# EAGLE design RouteurPV2107d (EAGLE 9.6.2)
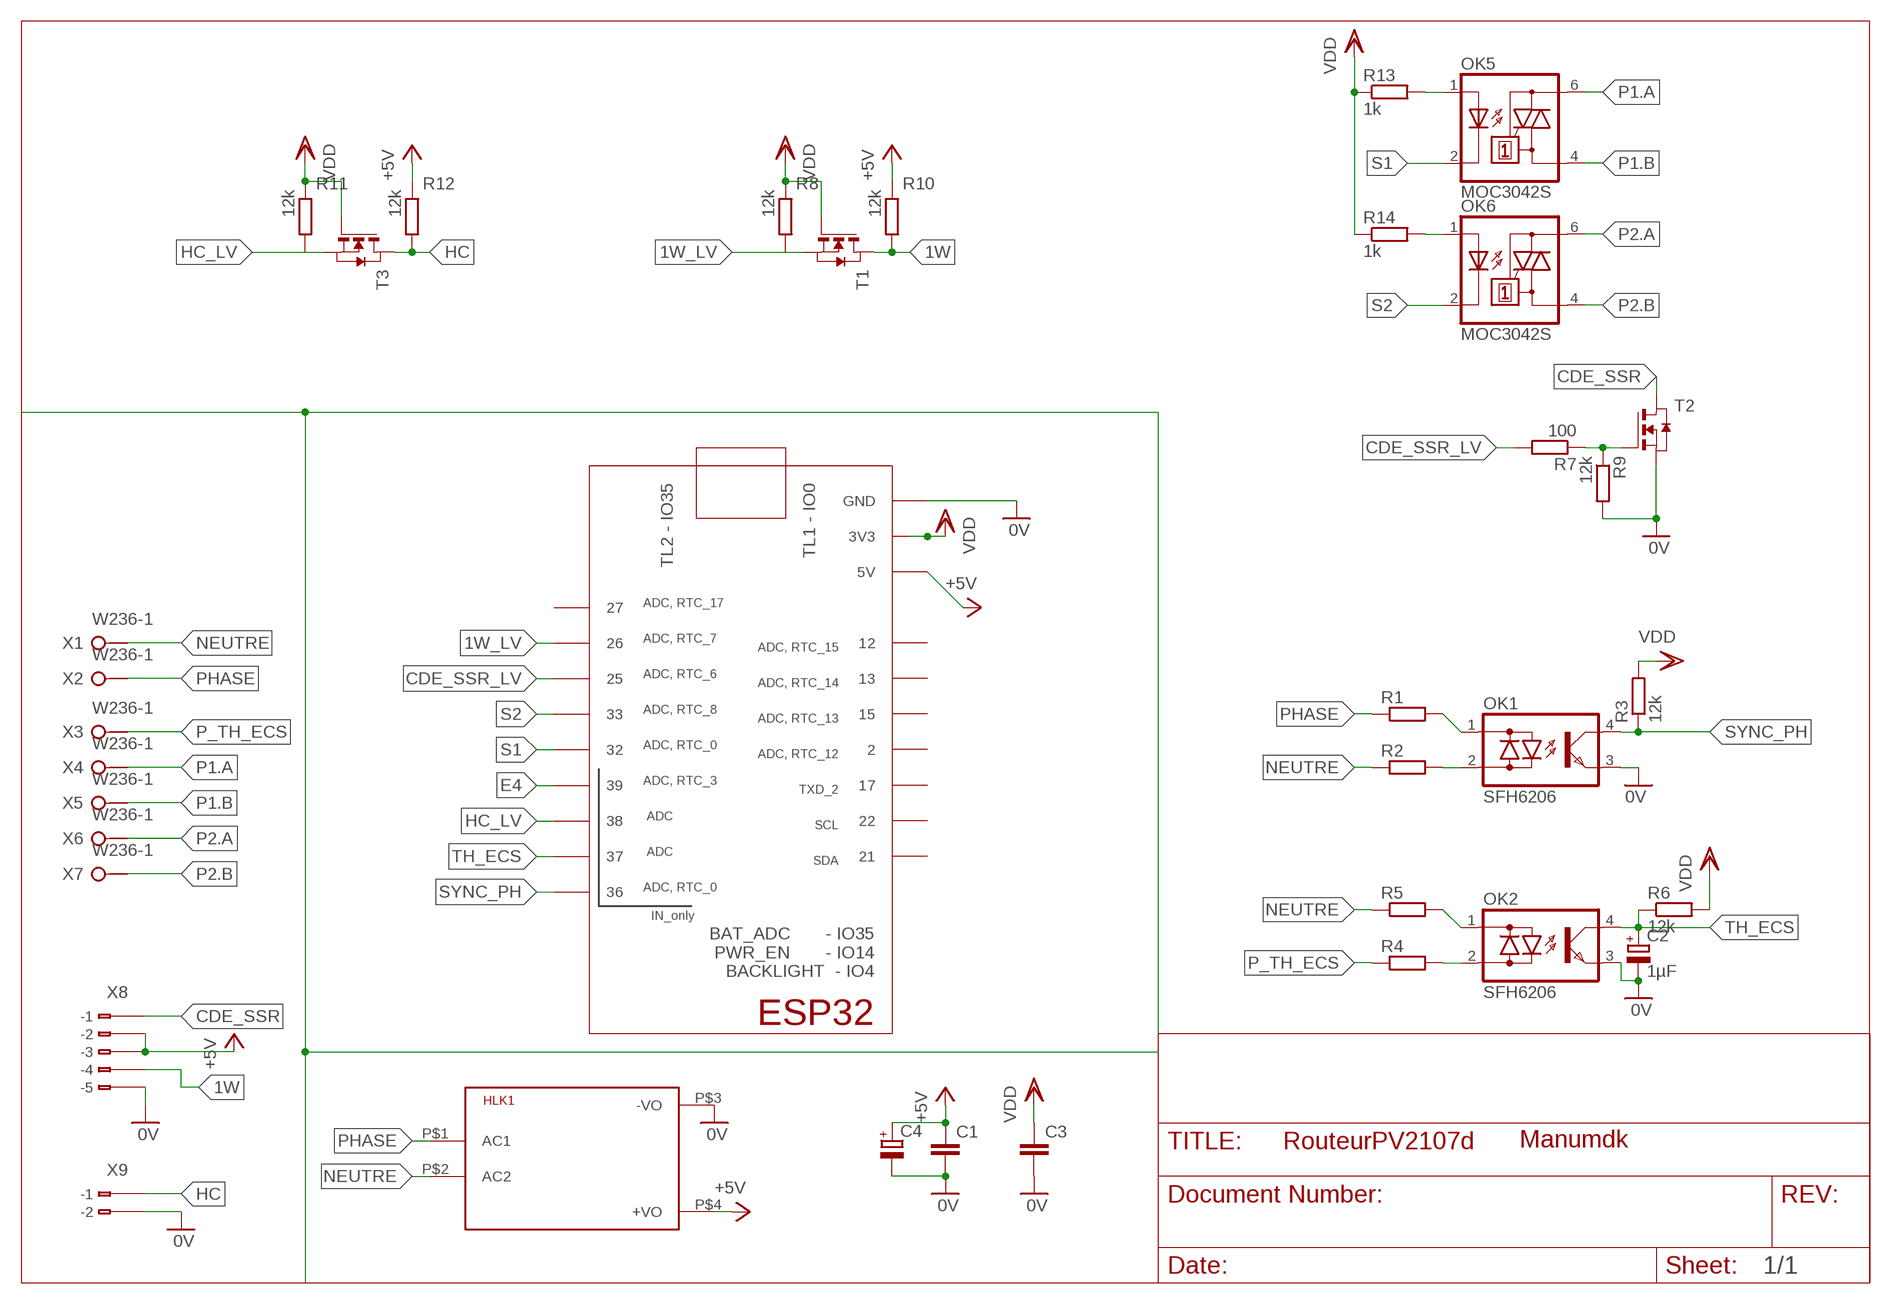
[diagram p0: schematic, sheet 1]
FRAME1 (DINA4_L): QUI: Manumdk

## Parts
C1  C-EUC1206  [C1206]
C2  1µF  CPOL-EUR/2012-12R  [R/2012-12R]
C3  C-EUC1206  [C1206]
C4  CPOL-EUSMCC  [SMC_C]
HLK1  HLK-PM013W  [HLK-PM01]
IC1  TTGO_DISP  [TTGO_DISP_DEFAULT]
OK1  SFH6206  [DIL4-SMD]
OK2  SFH6206  [DIL4-SMD]
OK5  MOC3042S  [DIL6-SMD]
OK6  MOC3042S  [DIL6-SMD]
R1  R-EU_R2512  [R2512]
R2  R-EU_R2512  [R2512]
R3  12k  R-EU_R1206  [R1206]
R4  R-EU_R2512  [R2512]
R5  R-EU_R2512  [R2512]
R6  12k  R-EU_R1206  [R1206]
R7  100  R-EU_R1206  [R1206]
R8  12k  R-EU_R1206  [R1206]
R9  12k  R-EU_R1206  [R1206]
R10  12k  R-EU_R1206  [R1206]
R11  12k  R-EU_R1206  [R1206]
R12  12k  R-EU_R1206  [R1206]
R13  1k  R-EU_R1206  [R1206]
R14  1k  R-EU_R1206  [R1206]
T1  NMOSSOT23  [SOT-23]
T2  NMOSSOT23  [SOT-23]
T3  NMOSSOT23  [SOT-23]
X1  W236-1  [W236-1]
X2  W236-1  [W236-1]
X3  W236-1  [W236-1]
X4  W236-1  [W236-1]
X5  W236-1  [W236-1]
X6  W236-1  [W236-1]
X7  W236-1  [W236-1]
X8  233-505  [233-505]
X9  233-102  [233-102]

## Nets
0V [Alim]: C1.2 C2.- C3.2 C4.- HLK1.P$3(-VO) IC1.GND_1(GND) IC1.GND_2(GND) IC1.GND_3(GND) IC1.GND_4(GND) IC1.GND_5(GND) OK1.3(E) OK2.3(E) R9.2 T2.2(S) X8.B5(B-5) X9.B2(B-2)
1W: R10.2 T1.1(D) X8.B4(B-4)
1W_LV: IC1.26 R8.2 T1.2(S)
+5V [Alim]: C1.1 C4.+ HLK1.P$4(+VO) IC1.5V R10.1 R12.1 X8.B2(B-2) X8.B3(B-3)
CDE_SSR: T2.1(D) X8.B1(B-1)
CDE_SSR_LV: IC1.25 R7.2
E4: IC1.39
HC: R12.2 T3.1(D) X9.B1(B-1)
HC_LV: IC1.38 R11.2 T3.2(S)
N$1 [220V]: OK1.1(AC1) R1.2
N$2: R7.1 R9.1 T2.3(G)
N$6 [220V]: OK1.2(AC2) R2.2
N$7 [220V]: OK2.2(AC2) R4.2
N$10 [220V]: OK2.1(AC1) R5.2
N$25: OK5.1(A) R13.2
N$26: OK6.1(A) R14.2
NEUTRE [220V]: HLK1.P$2(AC2) R2.1 R5.1 X1.1(KL1)
P1.A [220V]: OK5.6(A2) X4.1(KL1)
P1.B [220V]: OK5.4(A1) X5.1(KL1)
P2.A [220V]: OK6.6(A2) X6.1(KL1)
P2.B [220V]: OK6.4(A1) X7.1(KL1)
P_TH_ECS [220V]: R4.1 X3.1(KL1)
PHASE [220V]: HLK1.P$1(AC1) R1.1 X2.1(KL1)
S1: IC1.32 OK5.2(C)
S2: IC1.33 OK6.2(C)
SYNC_PH: IC1.36 OK1.4(C) R3.1
TH_ECS: C2.+ IC1.37 OK2.4(C) R6.1
VDD [Alim]: C3.1 IC1.3V3_1(3V3) IC1.3V3_2(3V3) R3.2 R6.2 R8.1 R11.1 R13.1 R14.1 T1.3(G) T3.3(G)
Unconnected: IC1.2 IC1.12 IC1.13 IC1.15 IC1.17 IC1.21 IC1.22 IC1.27 X1.2(KL2) X2.2(KL2) X3.2(KL2) X4.2(KL2) X5.2(KL2) X6.2(KL2) X7.2(KL2) X8.A1(-1) X8.A2(-2) X8.A3(-3) X8.A4(-4) X8.A5(-5) X9.A1(-1) X9.A2(-2)

## Library data of the parts
C1 C3 = rcl:C-EU: CAPACITOR, European symbol; SPICEPREFIX: C
C2 C4 = rcl:CPOL-EU: POLARIZED CAPACITOR, European symbol; SPICEPREFIX: C
HLK1 = HLK-PM01:HLK-PM01: Hi-Link Power Supply HLK-PM01 3W Author: Ahmed Said <https://github.com/AhmedSaid/EAGLELibraries>
IC1 = TTGO_LCD_DISP:TTGO_DISP; HEIGHT: 11
OK1 OK2 = optocoupler:SFH620: Optocoupler, Phototransistor Output, AC Input Source: http://www.vishay.com/docs/83675/sfh620.pdf; MF: VISHAY/TELEFUNKEN; MPN: SFH6206-3; OC_FARNELL: 1469585; OC_NEWARK: 58K2214
OK5 OK6 = optocoupler:MOC30*: 6-Pin DIP Zero-Cross Optoisolators Triac Driver Output (250/400 Volt Peak) Source: Data sheet <http://www.fairchildsemi.com/ds/MO/MOC3031M.pdf> The old path of data sheet not more available 2013-05-06.; MF: FAIRCHILD SEMICONDUCTOR; MPN: MOC3042SM; OC_FARNELL: unknown; OC_NEWARK: 34C1339
R1-R14 = rcl:R-EU_: RESISTOR, European symbol; SPICEPREFIX: R
T1-T3 = zetex:NMOSSOT23: MOS FET; OC_FARNELL: unknown; OC_NEWARK: unknown
X1-X7 = con-wago-508:W236-1: WAGO SREW CLAMP; OC_FARNELL: unknown; OC_NEWARK: unknown
X8 = con-wago:233-505: WAGO Cage Clamp; MF: Wago Corporation; MPN: 0233-0505; OC_FARNELL: unknown; OC_NEWARK: 79K2051
X9 = con-wago:233-102: WAGO Cage Clamp; MPN: 233-102; OC_FARNELL: unknown; OC_NEWARK: 28K9044

## Net classes
1 220V: width 1 mm, clearance 1.2 mm to class 0, clearance 1.2 mm
2 Alim: width 1 mm

## Board
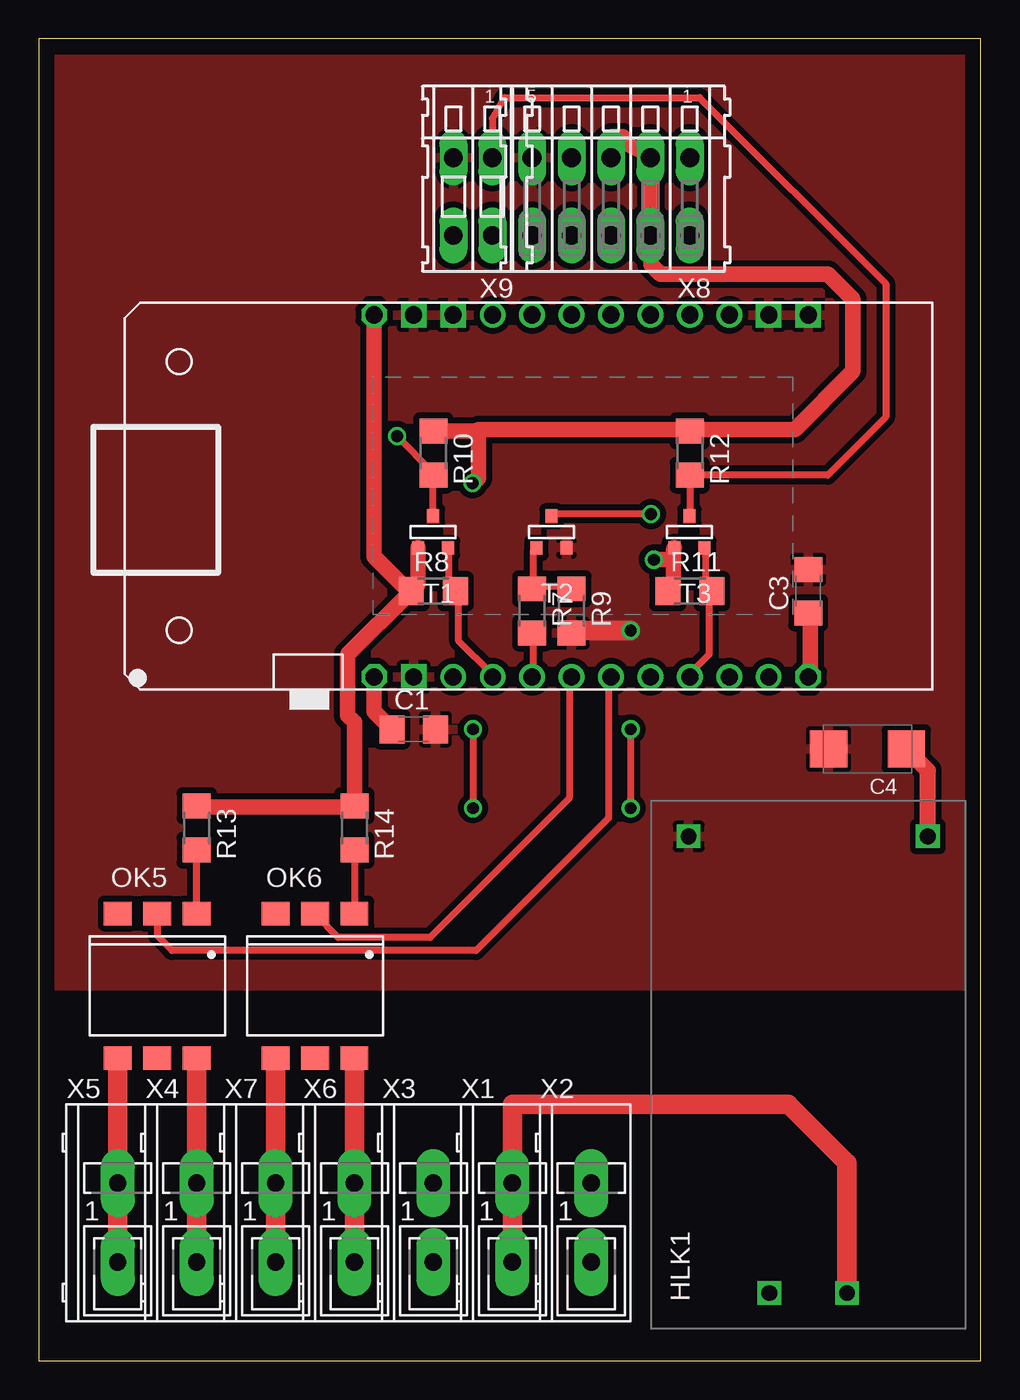
[diagram p1: board, top side]
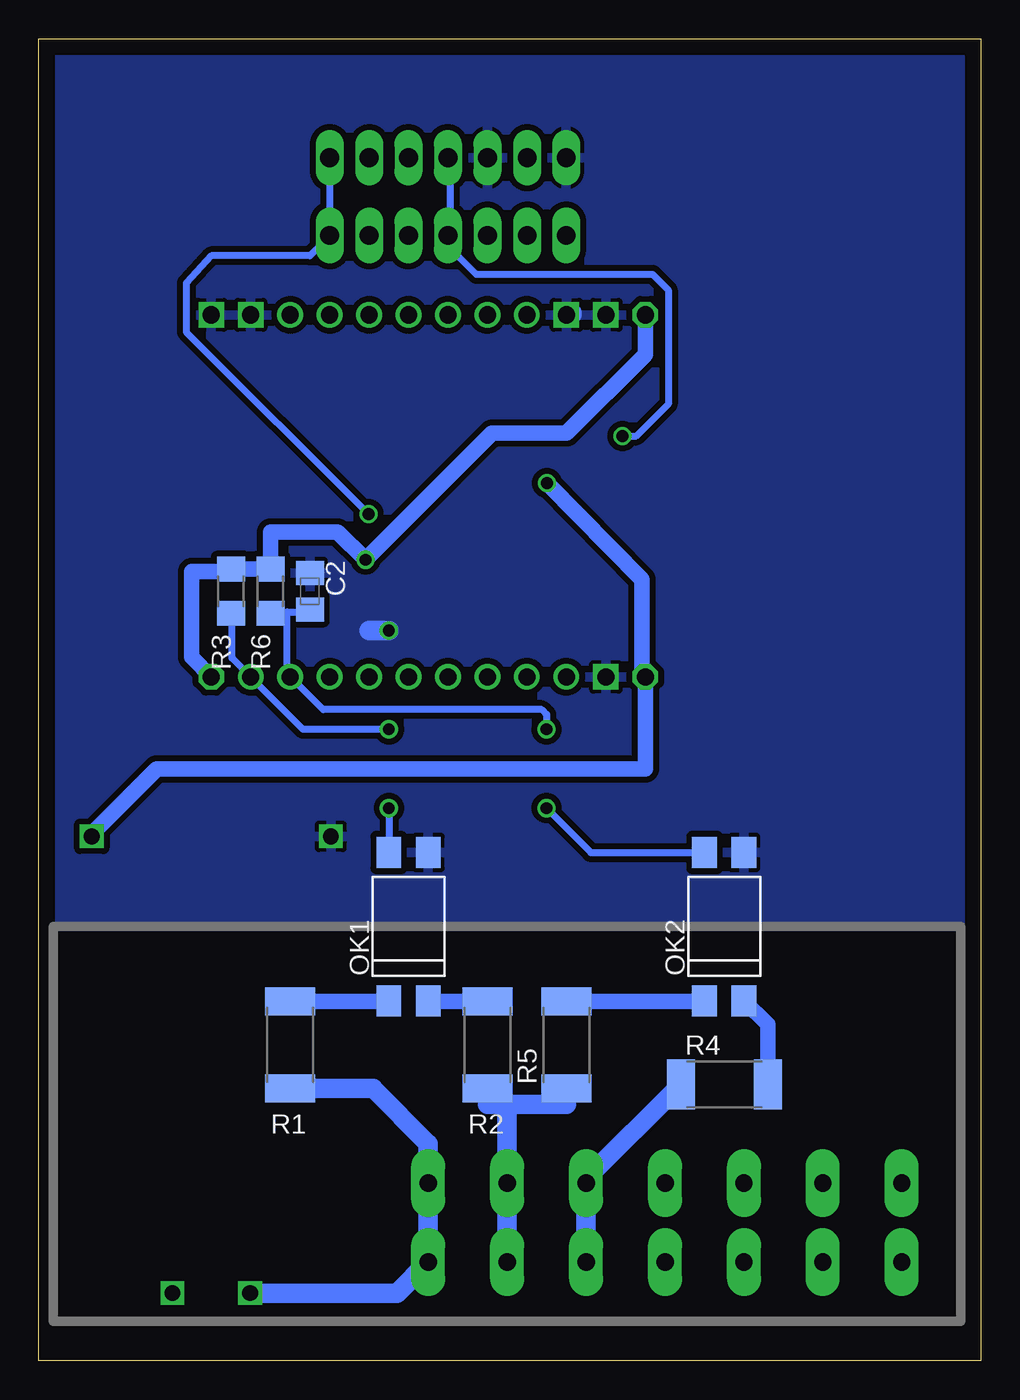
[diagram p2: board, bottom side, seen from below]

Size 60.63 x 85.08 mm. Coordinates in mm from the lower left corner, seen from the top.
Outline: 0,0 60.63,0 60.63,85.08 0,85.08 0,0
Copper layers (1*16): Top 0.035mm / dielectric 1.5mm / Bottom 0.035mm
Design rules "Manu1610a": minimum track width 18mil, minimum drill 30mil, track to track 15mil, track to pad 15mil, pad to pad 15mil, via to via 15mil, smd to smd 8mil, copper to edge 40mil, drill to drill 8mil, minimum pad ring 10mil, minimum via ring 8mil, stop-mask expansion 4mil, vias tented up to drill 0mil, thermal gap 10mil

### Footprints (pad centres in the part's own frame; a part is rotated, then mirrored left to right if it is on the bottom)
C1206 = smd 1.6 x 1.8: 1 -1.4,0; 2 1.4,0
R/2012-12R = smd 1.55 x 1.8: + 1.175,0; - -1.175,0
SMC_C = smd 2.4 x 2.4: + -2.5,0; - 2.5,0
HLK-PM01 = drill 1.016 square: P$1 -14.7,2.5; P$2 -14.7,-2.5; P$3 14.7,7.7; P$4 14.7,-7.7
TTGO_DISP_DEFAULT = drill 1.1: 2 12.7,0; 12 20.32,0; 13 17.78,0; 15 15.24,0; 17 10.16,0; 21 5.08,0; 22 7.62,0; 25 17.78,23.3; 26 20.32,23.3; 27 22.86,23.3; 32 12.7,23.3; 33 15.24,23.3; 36 2.54,23.3; 37 5.08,23.3; 38 7.62,23.3; 39 10.16,23.3 | drill 1.1 octagon: 3V3_1 0,23.3; 3V3_2 27.94,0; 5V 27.94,23.3 | drill 1.1 square: GND_1 0,0; GND_2 2.54,0; GND_3 22.86,0; GND_4 25.4,0; GND_5 25.4,23.3
DIL4-SMD = smd 1.6 x 2: 1 -1.27,-4.77; 2 1.27,-4.77; 3 1.27,4.77; 4 -1.27,4.77
DIL6-SMD = smd 1.78 x 1.52: 1 -2.54,-4.645; 2 0,-4.645; 3 2.54,-4.645; 4 2.54,4.645; 5 0,4.645; 6 -2.54,4.645
R2512 = smd 1.8 x 3.2: 1 -2.8,0; 2 2.8,0
R1206 = smd 1.6 x 1.803: 1 -1.422,0; 2 1.422,0
SOT-23 = smd 0.787 x 0.889: 1 0.025,-1.016; 2 -0.94,1.016; 3 0.991,1.016
W236-1 = drill 1.118 pad 2.184 long: 1 0,-2.54; 2 0,2.54
233-505 = drill 1.2 long: A1 -5.08,2.5; A2 -2.54,2.5; A3 0,2.5; A4 2.54,2.5; A5 5.08,2.5; B1 -5.08,-2.5; B2 -2.54,-2.5; B3 0,-2.5; B4 2.54,-2.5; B5 5.08,-2.5
233-102 = drill 1.2 long: A1 -1.25,2.5; A2 1.25,2.5; B1 -1.25,-2.5; B2 1.25,-2.5

### Placement (x,y rotation side)
C1  24.13,40.64 0 top
C2  43.18,49.53 270 bottom
C3  49.53,49.53 90 top
C4  53.34,39.37 180 top
HLK1  49.53,19.05 90 top
IC1  49.53,67.31 180 top
OK1  36.83,27.94 0 bottom
OK2  16.51,27.94 0 bottom
OK5  7.62,24.13 180 top
OK6  17.78,24.13 180 top
R1  44.45,20.32 90 bottom
R2  31.75,20.32 90 bottom
R3  48.26,49.53 90 bottom
R4  16.51,17.78 0 bottom
R5  26.67,20.32 90 bottom
R6  45.72,49.53 90 bottom
R7  31.75,48.26 270 top
R8  25.4,49.53 0 top
R9  34.29,48.26 270 top
R10  25.4,58.42 270 top
R11  41.91,49.53 0 top
R12  41.91,58.42 270 top
R13  10.16,34.29 270 top
R14  20.32,34.29 270 top
T1  25.4,53.34 180 top
T2  33.02,53.34 180 top
T3  41.91,53.34 180 top
X1  30.48,8.89 0 top
X2  35.56,8.89 0 top
X3  25.4,8.89 0 top
X4  10.16,8.89 0 top
X5  5.08,8.89 0 top
X6  20.32,8.89 0 top
X7  15.24,8.89 0 top
X8  36.83,74.93 180 top
X9  27.94,74.93 180 top

### Tracks (layer width: path | path; a pad name or v marks a point on that pad's centre or on a via)
0V  (via drill 0.76)
  Top 1.27: R9.2 34.44,46.99 v38.1,46.99
  Bottom 1: 26.19,67.31 26.19,67.47 IC1.GND_3
  Bottom 1.27: v38.1,46.99 39.37,46.99
  pour Top (isolate 0.254): 59.69,24.13 59.69,85.09 0,85.09 0,24.13
  pour Bottom (isolate 0.254): 59.69,27.94 59.69,83.82 1.27,83.82 1.27,27.94
1W  (via drill 0.76)
  Top 0.457: T1.1 25.36,54.48 25.36,57 R10.2 25.36,57.21 v23.05,59.51
  Bottom 0.457: v23.05,59.51 22.16,59.51 20.12,61.56 20.12,68.92 21.13,69.93 32.48,69.93 34.16,71.6 34.16,77.31 X8.B4
1W_LV
  Top 0.457: T1.2 26.4,52.18 26.4,49.87 26.61,49.66 R8.2 27.03,49.45 27.03,46.31 29.13,44.22 IC1.26
+5V  (via drill 0.76)
  Top 1: X8.B3 37.59,78.79 36.88,78.79 39.11,77.69 X8.B2 39.4,77.31 39.4,70.54 40.01,69.93 50.79,69.93 52.4,68.31 52.4,63.68 48.65,59.93 42.12,59.93 R12.1 41.91,59.93 28.3,59.93 | 28.3,59.93 28.3,56.8 v27.91,56.5 | IC1.5V 21.59,41.78 C1.1 | R10.1 28.21,59.84 28.3,59.93
  Top 1.016: HLK1.P$4 57.23,37.98 C4.+
  Bottom 1: v27.91,56.5 21.79,50.29 21.79,44.22 IC1.5V 21.59,38.1 53.05,38.1 57.21,33.95 HLK1.P$4
CDE_SSR  (via drill 0.76)
  Top 0.457: v39.4,54.48 33.11,54.48 T2.1
  Bottom 0.457: v39.4,54.48 51.13,66.22 51.13,69.36 49.53,71.12 43.18,71.12 41.91,72.39 X8.B1
CDE_SSR_LV
  Top 0.457: R7.2 31.85,46.73 31.85,44.22 IC1.25
HC
  Top 0.457: T3.1 41.91,54.48 R12.2 42.12,57 50.79,57 54.51,60.72 54.51,69.34 42.54,81.31 29.95,81.31 29.19,79.97 X9.B1
HC_LV
  Top 0.457: T3.2 42.96,52.18 42.96,49.87 43.17,49.66 R11.2 43.17,49.45 43.17,45.47 41.91,44.22 IC1.38
N$1
  Bottom 1: R1.2 38.15,23.12 OK1.1
N$2
  Top 0.457: T2.3 31.85,52.18 31.85,49.87 R7.1 32.06,49.87 34.16,49.87 R9.1
N$6
  Bottom 1: R2.2 35.51,23.12 OK1.2
N$7
  Bottom 1: R4.2 13.71,21.64 OK2.2
N$10
  Bottom 1: R5.2 17.83,23.12 OK2.1
N$25
  Top 0.457: OK5.1 R13.2
N$26
  Top 0.457: OK6.1 20.33,28.92 20.33,32.69 R14.2
NEUTRE
  Top 1.27: X1.1 30.48,16.51 48.26,16.51 52.03,12.74 HLK1.P$2
  Bottom 1.27: R5.1 26.67,16.51 30.48,16.51 | 30.48,16.51 31.75,16.51 R2.1 | X1.1 30.48,16.51
P1.A
  Top 1.27: OK5.6 X4.1
P1.B
  Top 1.27: X5.1 OK5.4
P2.A
  Top 1.27: X6.1 OK6.6
P2.B
  Top 1.27: X7.1 OK6.4
P_TH_ECS
  Bottom 1.27: R4.1 25.4,11.69 X3.1
PHASE
  Bottom 1.27: HLK1.P$1 37.56,4.35 X2.1 35.56,13.97 39.11,17.52 R1.1
S1
  Top 0.457: OK5.2 7.62,27.36 8.58,26.4 28.14,26.4 36.67,34.93 36.67,44.01 IC1.32
S2
  Top 0.457: OK6.2 17.81,28.71 19.28,27.24 25.18,27.24 34.16,36.21 34.16,44.01 IC1.33
SYNC_PH  (via drill 0.76)
  Top 0.457: v38.1,40.64 v38.1,35.56
  Bottom 0.457: R3.1 48.2,47.78 48.2,45.22 IC1.36 43.62,40.64 v38.1,40.64 | v38.1,35.56 OK1.4
TH_ECS  (via drill 0.76)
  Top 0.457: v27.94,40.64 v27.94,35.56
  Bottom 0.457: 44.63,48.2 45.68,48.2 R6.1 | 44.63,48.2 43.38,48.2 C2.+ | 44.63,48.2 44.63,44.22 IC1.37 44.42,44.01 42.33,41.91 28.25,41.91 27.94,41.6 v27.94,40.64 | v27.94,35.56 25.09,32.71 OK2.4
VDD  (via drill 0.76)
  Top 1: 40.86,51.55 40.86,49.87 40.65,49.66 R11.1 | 40.86,51.55 40.86,52.18 T3.3 | v39.6,51.55 40.86,51.55 | R13.1 10.32,35.62 20.12,35.62 R14.1 20.32,41.1 19.88,41.53 19.88,45.45 23.89,49.45 | 23.89,49.45 R8.1 24.41,49.96 T1.3 | C3.1 49.66,47.99 49.66,44.22 IC1.3V3_1 | IC1.3V3_2 21.59,60.12 21.59,51.76 23.89,49.45
  Bottom 1: IC1.3V3_2 21.59,64.77 26.67,59.69 31.46,59.69 v39.6,51.55 41.4,53.34 45.72,53.34 45.72,51.17 45.68,51.13 R6.2 R3.2 48.41,50.8 50.8,50.8 50.8,45.28 IC1.3V3_1

### Text on the board
tDocu: HC HC 0V 1W 5V 5V SSR | Danger 240 v | P1 P1 P2 P2 TH N Ph
bDocu: Danger 240 v | Danger 240 v | Danger 240 v